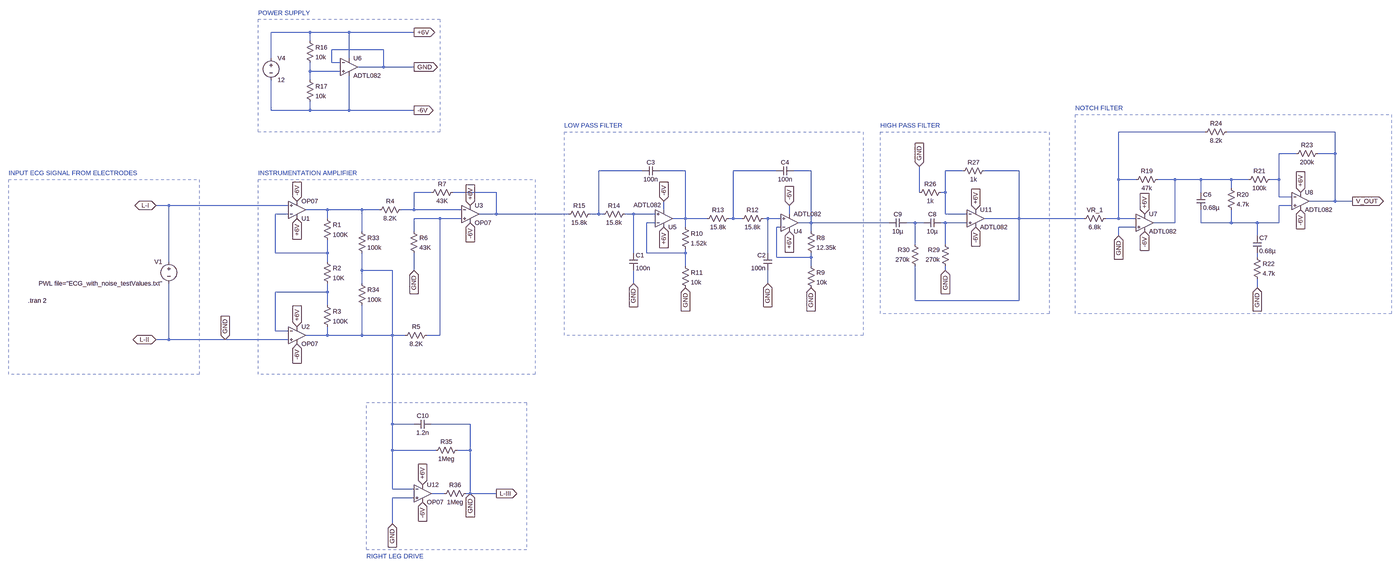
[diagram p0: schematic final_setup_with_opamp_power_supply.asc, whole sheet]
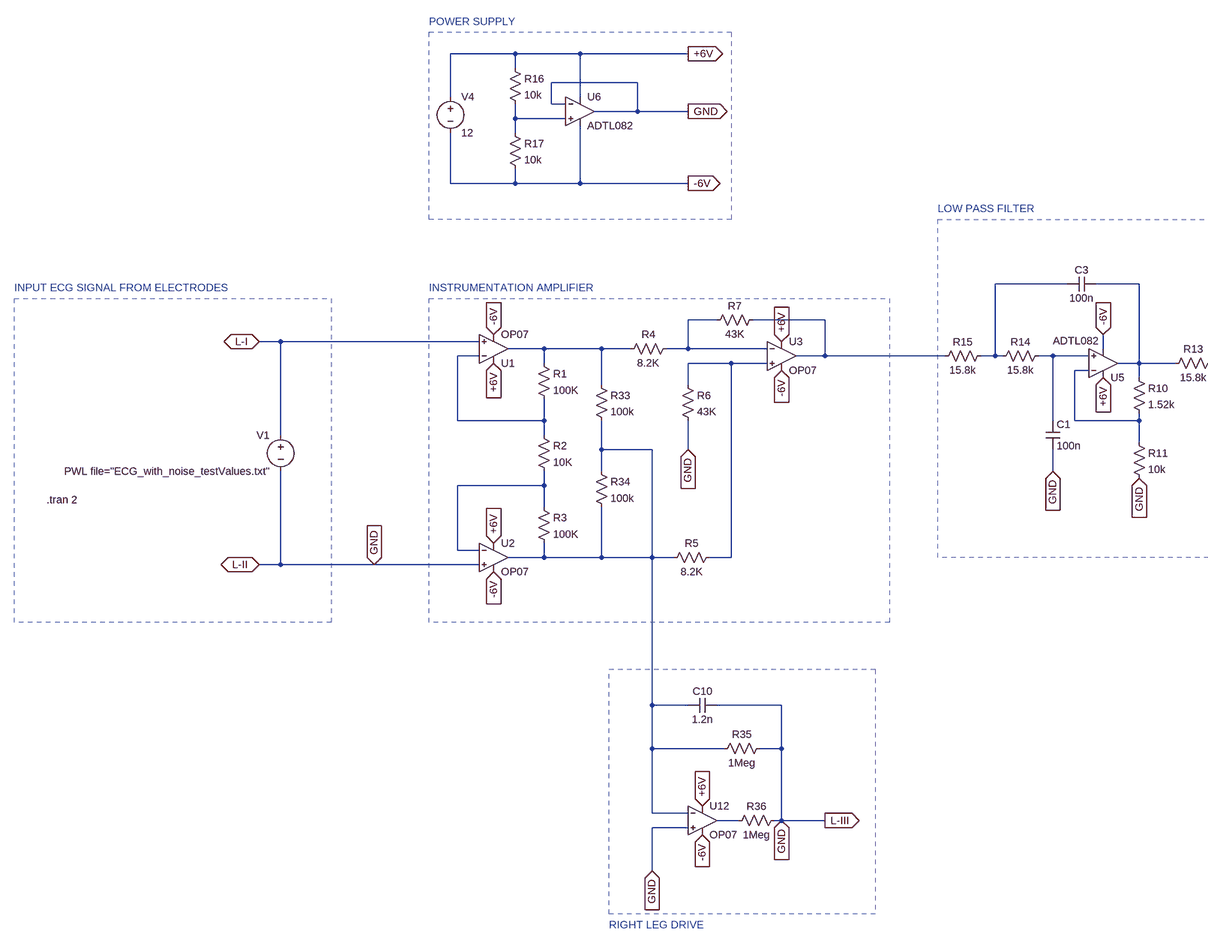
[diagram p1: schematic final_setup_with_opamp_power_supply.asc, part, row 1 of 1, column 1 of 2]
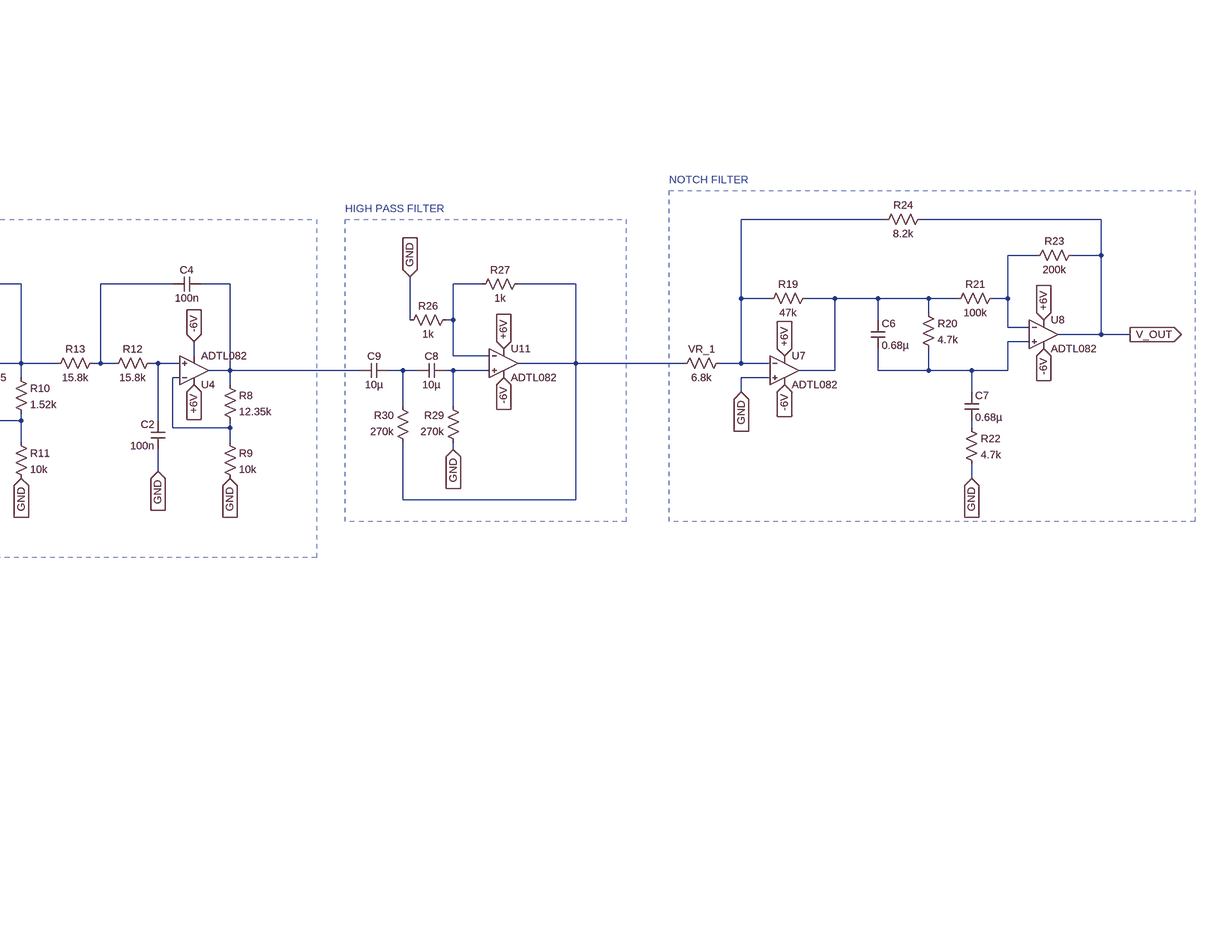
[diagram p2: schematic final_setup_with_opamp_power_supply.asc, part, row 1 of 1, column 2 of 2]
final_setup_with_opamp_power_supply.asc, the LTspice schematic file:
Version 4.1
SHEET 1 4228 1256
WIRE -592 -720 -736 -720
WIRE -448 -720 -592 -720
WIRE -208 -720 -448 -720
WIRE -592 -688 -592 -720
WIRE -320 -656 -512 -656
WIRE -736 -624 -736 -720
WIRE -448 -624 -448 -720
WIRE -512 -608 -512 -656
WIRE -480 -608 -512 -608
WIRE -320 -592 -320 -656
WIRE -320 -592 -416 -592
WIRE -208 -592 -320 -592
WIRE -592 -576 -592 -608
WIRE -480 -576 -592 -576
WIRE -592 -544 -592 -576
WIRE -736 -432 -736 -544
WIRE -592 -432 -592 -464
WIRE -592 -432 -736 -432
WIRE -448 -432 -448 -560
WIRE -448 -432 -592 -432
WIRE -208 -432 -448 -432
WIRE 2720 -352 2400 -352
WIRE 3200 -352 2800 -352
WIRE 3056 -272 2992 -272
WIRE 3200 -272 3200 -352
WIRE 3200 -272 3136 -272
WIRE 640 -208 480 -208
WIRE 800 -208 704 -208
WIRE 1136 -208 976 -208
WIRE 1264 -208 1200 -208
WIRE 1824 -208 1760 -208
WIRE 2032 -208 1904 -208
WIRE 2400 -176 2400 -352
WIRE 2464 -176 2400 -176
WIRE 2608 -176 2544 -176
WIRE 2704 -176 2608 -176
WIRE 2816 -176 2704 -176
WIRE 2880 -176 2816 -176
WIRE 2992 -176 2992 -272
WIRE 2992 -176 2960 -176
WIRE 2816 -144 2816 -176
WIRE -144 -128 -208 -128
WIRE 96 -128 -64 -128
WIRE 1664 -128 1664 -224
WIRE 1760 -128 1760 -208
WIRE 1760 -128 1744 -128
WIRE 2704 -128 2704 -176
WIRE 2992 -112 2992 -176
WIRE 3040 -112 2992 -112
WIRE 3200 -96 3200 -272
WIRE 3200 -96 3104 -96
WIRE 3264 -96 3200 -96
WIRE -1120 -80 -1168 -80
WIRE -672 -80 -1120 -80
WIRE 3040 -80 2992 -80
WIRE -528 -64 -608 -64
WIRE -400 -64 -528 -64
WIRE -336 -64 -400 -64
WIRE -208 -64 -208 -128
WIRE -208 -64 -256 -64
WIRE -32 -64 -208 -64
WIRE 720 -64 720 -96
WIRE -672 -48 -720 -48
WIRE 96 -48 96 -128
WIRE 96 -48 32 -48
WIRE 368 -48 96 -48
WIRE 480 -48 480 -208
WIRE 480 -48 448 -48
WIRE 496 -48 480 -48
WIRE 608 -48 576 -48
WIRE 688 -48 608 -48
WIRE 1184 -48 1184 -80
WIRE 1760 -48 1760 -128
WIRE 1840 -48 1760 -48
WIRE -528 -32 -528 -64
WIRE -112 -32 -208 -32
WIRE -32 -32 -112 -32
WIRE 800 -32 800 -208
WIRE 800 -32 752 -32
WIRE 880 -32 800 -32
WIRE 976 -32 976 -208
WIRE 976 -32 960 -32
WIRE 1008 -32 976 -32
WIRE 1104 -32 1088 -32
WIRE 1152 -32 1104 -32
WIRE 2032 -32 2032 -208
WIRE 2032 -32 1904 -32
WIRE 2272 -32 2032 -32
WIRE 2400 -32 2400 -176
WIRE 2400 -32 2352 -32
WIRE 2464 -32 2400 -32
WIRE 688 -16 656 -16
WIRE 1264 -16 1264 -208
WIRE 1264 -16 1216 -16
WIRE 1552 -16 1264 -16
WIRE 1648 -16 1616 -16
WIRE 1680 -16 1648 -16
WIRE 1760 -16 1744 -16
WIRE 1840 -16 1760 -16
WIRE 2608 -16 2608 -176
WIRE 2608 -16 2528 -16
WIRE 2704 -16 2704 -64
WIRE 2816 -16 2816 -64
WIRE 2816 -16 2704 -16
WIRE 2912 -16 2816 -16
WIRE 2992 -16 2992 -80
WIRE 2992 -16 2912 -16
WIRE 800 0 800 -32
WIRE 1152 0 1136 0
WIRE 2464 0 2400 0
WIRE -400 16 -400 -64
WIRE -208 16 -208 -32
WIRE 1264 16 1264 -16
WIRE 2400 32 2400 0
WIRE 2912 32 2912 -16
WIRE 1648 64 1648 -16
WIRE 1760 64 1760 -16
WIRE -720 96 -720 -48
WIRE -528 96 -528 48
WIRE -528 96 -720 96
WIRE 608 96 608 -48
WIRE 656 96 656 -16
WIRE 800 96 800 80
WIRE 800 96 656 96
WIRE 1104 96 1104 -32
WIRE 1136 112 1136 0
WIRE 1264 112 1264 96
WIRE 1264 112 1136 112
WIRE 2912 112 2912 96
WIRE -1120 128 -1120 -80
WIRE -528 128 -528 96
WIRE 800 144 800 96
WIRE 1264 144 1264 112
WIRE -400 160 -400 96
WIRE -288 160 -400 160
WIRE -208 160 -208 96
WIRE 1760 160 1760 144
WIRE -400 208 -400 160
WIRE 608 208 608 160
WIRE 1104 208 1104 160
WIRE 2912 224 2912 192
WIRE -528 240 -528 208
WIRE -528 240 -720 240
WIRE 1648 272 1648 144
WIRE 2032 272 2032 -32
WIRE 2032 272 1648 272
WIRE -528 288 -528 240
WIRE -720 384 -720 240
WIRE -672 384 -720 384
WIRE -528 400 -528 368
WIRE -528 400 -608 400
WIRE -400 400 -400 288
WIRE -400 400 -528 400
WIRE -288 400 -288 160
WIRE -288 400 -400 400
WIRE -240 400 -288 400
WIRE -112 400 -112 -32
WIRE -112 400 -160 400
WIRE -1120 416 -1120 208
WIRE -1120 416 -1168 416
WIRE -912 416 -1120 416
WIRE -672 416 -912 416
WIRE -288 752 -288 400
WIRE -208 752 -288 752
WIRE 0 752 -144 752
WIRE -288 848 -288 752
WIRE -128 848 -288 848
WIRE 0 848 0 752
WIRE 0 848 -48 848
WIRE -288 992 -288 848
WIRE -208 992 -288 992
WIRE -96 1008 -144 1008
WIRE 0 1008 0 848
WIRE 0 1008 -16 1008
WIRE 96 1008 0 1008
WIRE -208 1024 -288 1024
WIRE -288 1120 -288 1024
FLAG -640 -32 +6V
IOPIN -640 -32 In
FLAG -640 368 +6V
IOPIN -640 368 In
FLAG -640 -96 -6V
IOPIN -640 -96 In
FLAG -640 432 -6V
IOPIN -640 432 In
FLAG 0 -16 -6V
IOPIN 0 -16 In
FLAG 0 -80 +6V
IOPIN 0 -80 In
FLAG -1168 -80 L-I
IOPIN -1168 -80 BiDir
FLAG -1168 416 L-II
IOPIN -1168 416 BiDir
FLAG 720 0 +6V
IOPIN 720 0 In
FLAG 1184 16 +6V
IOPIN 1184 16 In
FLAG 720 -96 -6V
IOPIN 720 -96 In
FLAG 1184 -80 -6V
IOPIN 1184 -80 In
FLAG 2496 -48 +6V
IOPIN 2496 -48 In
FLAG 3072 -128 +6V
IOPIN 3072 -128 In
FLAG 2496 16 -6V
IOPIN 2496 16 In
FLAG 3072 -64 -6V
IOPIN 3072 -64 In
FLAG 1872 -64 +6V
IOPIN 1872 -64 In
FLAG 1872 0 -6V
IOPIN 1872 0 In
FLAG -912 416 GND
IOPIN -912 416 In
FLAG -208 160 GND
IOPIN -208 160 In
FLAG 608 208 GND
IOPIN 608 208 In
FLAG 800 224 GND
IOPIN 800 224 In
FLAG 1104 208 GND
IOPIN 1104 208 In
FLAG 1264 224 GND
IOPIN 1264 224 In
FLAG 1664 -224 GND
IOPIN 1664 -224 In
FLAG 1760 160 GND
IOPIN 1760 160 In
FLAG 2400 32 GND
IOPIN 2400 32 In
FLAG 2912 224 GND
IOPIN 2912 224 In
FLAG -176 976 +6V
IOPIN -176 976 In
FLAG -176 1040 -6V
IOPIN -176 1040 In
FLAG -288 1120 GND
IOPIN -288 1120 In
FLAG 96 1008 L-III
IOPIN 96 1008 Out
FLAG 0 1008 GND
IOPIN 0 1008 In
FLAG 3264 -96 V_OUT
IOPIN 3264 -96 Out
FLAG -208 -720 +6V
IOPIN -208 -720 Out
FLAG -208 -432 -6V
IOPIN -208 -432 Out
FLAG -208 -592 GND
IOPIN -208 -592 Out
SYMBOL OpAmps/OP07 -640 0 M180
SYMATTR InstName U1
SYMBOL Res -544 -48 R0
SYMATTR InstName R1
SYMATTR Value 100K
SYMBOL Res -544 112 R0
SYMATTR InstName R2
SYMATTR Value 10K
SYMBOL Res -544 272 R0
SYMATTR InstName R3
SYMATTR Value 100K
SYMBOL OpAmps/OP07 -640 336 R0
SYMATTR InstName U2
SYMBOL Voltage -1120 112 M0
WINDOW 123 0 0 Left 0
WINDOW 39 0 0 Left 0
SYMATTR InstName V1
SYMATTR Value PWL file="ECG_with_noise_testValues.txt"
SYMBOL Res -240 -80 R90
WINDOW 0 0 56 VBottom 2
WINDOW 3 32 56 VTop 2
SYMATTR InstName R4
SYMATTR Value 8.2K
SYMBOL Res -144 384 R90
WINDOW 0 0 56 VBottom 2
WINDOW 3 32 56 VTop 2
SYMATTR InstName R5
SYMATTR Value 8.2K
SYMBOL Res -224 0 R0
SYMATTR InstName R6
SYMATTR Value 43K
SYMBOL ADTL082 1184 48 M180
SYMATTR InstName U4
SYMBOL ADTL082 720 32 M180
WINDOW 3 -112 114 Left 2
SYMATTR InstName U5
SYMBOL res 1248 0 R0
SYMATTR InstName R8
SYMATTR Value 12.35k
SYMBOL res 1248 128 R0
SYMATTR InstName R9
SYMATTR Value 10k
SYMBOL res 784 -16 R0
SYMATTR InstName R10
SYMATTR Value 1.52k
SYMBOL res 784 128 R0
SYMATTR InstName R11
SYMATTR Value 10k
SYMBOL cap 592 96 R0
SYMATTR InstName C1
SYMATTR Value 100n
SYMBOL cap 1120 96 M0
SYMATTR InstName C2
SYMATTR Value 100n
SYMBOL res 1104 -48 R90
WINDOW 0 0 56 VBottom 2
WINDOW 3 32 56 VTop 2
SYMATTR InstName R12
SYMATTR Value 15.8k
SYMBOL res 976 -48 R90
WINDOW 0 0 56 VBottom 2
WINDOW 3 32 56 VTop 2
SYMATTR InstName R13
SYMATTR Value 15.8k
SYMBOL res 592 -64 R90
WINDOW 0 0 56 VBottom 2
WINDOW 3 32 56 VTop 2
SYMATTR InstName R14
SYMATTR Value 15.8k
SYMBOL res 464 -64 R90
WINDOW 0 0 56 VBottom 2
WINDOW 3 32 56 VTop 2
SYMATTR InstName R15
SYMATTR Value 15.8k
SYMBOL cap 704 -224 R90
WINDOW 0 0 32 VBottom 2
WINDOW 3 32 32 VTop 2
SYMATTR InstName C3
SYMATTR Value 100n
SYMBOL cap 1200 -224 R90
WINDOW 0 0 32 VBottom 2
WINDOW 3 32 32 VTop 2
SYMATTR InstName C4
SYMATTR Value 100n
SYMBOL ADTL082 2496 -80 R0
SYMATTR InstName U7
SYMBOL ADTL082 3072 -160 R0
SYMATTR InstName U8
SYMBOL res 2368 -48 R90
WINDOW 0 0 56 VBottom 2
WINDOW 3 32 56 VTop 2
SYMATTR InstName VR_1
SYMATTR Value 6.8k
SYMATTR SpiceLine tol=5 pwr=0.25
SYMBOL res 2560 -192 R90
WINDOW 0 0 56 VBottom 2
WINDOW 3 32 56 VTop 2
SYMATTR InstName R19
SYMATTR Value 47k
SYMATTR SpiceLine tol=5 pwr=0.25
SYMBOL cap 2688 -128 R0
SYMATTR InstName C6
SYMATTR Value 0.68µ
SYMATTR SpiceLine V=50
SYMBOL res 2800 -160 R0
SYMATTR InstName R20
SYMATTR Value 4.7k
SYMATTR SpiceLine tol=5 pwr=0.25
SYMBOL res 2976 -192 R90
WINDOW 0 0 56 VBottom 2
WINDOW 3 32 56 VTop 2
SYMATTR InstName R21
SYMATTR Value 100k
SYMATTR SpiceLine tol=5 pwr=0.25
SYMBOL cap 2896 32 R0
SYMATTR InstName C7
SYMATTR Value 0.68µ
SYMATTR SpiceLine V=50
SYMBOL res 2896 96 R0
SYMATTR InstName R22
SYMATTR Value 4.7k
SYMATTR SpiceLine tol=5 pwr=0.25
SYMBOL res 3152 -288 R90
WINDOW 0 0 56 VBottom 2
WINDOW 3 32 56 VTop 2
SYMATTR InstName R23
SYMATTR Value 200k
SYMATTR SpiceLine tol=5 pwr=0.25
SYMBOL res 2816 -368 R90
WINDOW 0 0 56 VBottom 2
WINDOW 3 32 56 VTop 2
SYMATTR InstName R24
SYMATTR Value 8.2k
SYMATTR SpiceLine tol=5 pwr=0.25
SYMBOL cap 1744 -32 R90
WINDOW 0 0 32 VBottom 2
WINDOW 3 32 32 VTop 2
SYMATTR InstName C8
SYMATTR Value 10µ
SYMBOL cap 1616 -32 R90
WINDOW 0 0 32 VBottom 2
WINDOW 3 32 32 VTop 2
SYMATTR InstName C9
SYMATTR Value 10µ
SYMBOL res 1760 -144 R90
WINDOW 0 0 56 VBottom 2
WINDOW 3 32 56 VTop 2
SYMATTR InstName R26
SYMATTR Value 1k
SYMBOL res 1920 -224 R90
WINDOW 0 0 56 VBottom 2
WINDOW 3 32 56 VTop 2
SYMATTR InstName R27
SYMATTR Value 1k
SYMBOL res 1776 160 R180
WINDOW 0 36 76 Left 2
WINDOW 3 36 40 Left 2
SYMATTR InstName R29
SYMATTR Value 270k
SYMBOL res 1664 160 R180
WINDOW 0 36 76 Left 2
WINDOW 3 36 40 Left 2
SYMATTR InstName R30
SYMATTR Value 270k
SYMBOL ADTL082 1872 -96 R0
SYMATTR InstName U11
SYMBOL res -416 0 R0
SYMATTR InstName R33
SYMATTR Value 100k
SYMBOL res -416 192 R0
SYMATTR InstName R34
SYMATTR Value 100k
SYMBOL OpAmps/OP07 -176 944 R0
SYMATTR InstName U12
SYMBOL res -32 832 R90
WINDOW 0 0 56 VBottom 2
WINDOW 3 32 56 VTop 2
SYMATTR InstName R35
SYMATTR Value 1Meg
SYMBOL res 0 992 R90
WINDOW 0 0 56 VBottom 2
WINDOW 3 32 56 VTop 2
SYMATTR InstName R36
SYMATTR Value 1Meg
SYMBOL cap -144 736 R90
WINDOW 0 0 32 VBottom 2
WINDOW 3 32 32 VTop 2
SYMATTR InstName C10
SYMATTR Value 1.2n
SYMBOL OpAmps/OP07 0 -112 R0
SYMATTR InstName U3
SYMBOL Res -48 -144 R90
WINDOW 0 0 56 VBottom 2
WINDOW 3 32 56 VTop 2
SYMATTR InstName R7
SYMATTR Value 43K
SYMBOL voltage -736 -640 R0
WINDOW 123 0 0 Left 0
WINDOW 39 0 0 Left 0
SYMATTR InstName V4
SYMATTR Value 12
SYMBOL res -608 -704 R0
SYMATTR InstName R16
SYMATTR Value 10k
SYMBOL res -608 -560 R0
SYMATTR InstName R17
SYMATTR Value 10k
SYMBOL OpAmps\\ADTL082 -448 -656 R0
SYMATTR InstName U6
TEXT -1640 272 Left 2 !.tran 2
TEXT -1712 -200 Left 2 ;INPUT ECG SIGNAL FROM ELECTRODES
TEXT -784 -200 Left 2 ;INSTRUMENTATION AMPLIFIER
TEXT -384 1240 Left 2 ;RIGHT LEG DRIVE
TEXT 352 -376 Left 2 ;LOW PASS FILTER
TEXT 1520 -376 Left 2 ;HIGH PASS FILTER
TEXT 2240 -440 Left 2 ;NOTCH FILTER
TEXT -784 -792 Left 2 ;POWER SUPPLY
RECTANGLE Normal -1008 544 -1712 -176 1
RECTANGLE Normal 240 544 -784 -176 1
RECTANGLE Normal 208 1216 -384 672 1
RECTANGLE Normal 1456 400 352 -352 1
RECTANGLE Normal 2144 320 1520 -352 1
RECTANGLE Normal 2240 -432 2240 -432 1
RECTANGLE Normal 3408 320 2240 -416 1
RECTANGLE Normal -112 -352 -784 -768 1

The netlist it stands for:
* final_setup_with_opamp_power_supply.asc
X§U1 L-I N015 +6V -6V N014 LT1001  ; OP07, pins In+ In- V+ V- OUT
R1 N014 N015 100K
R2 N015 N025 10K
R3 N025 N024 100K
X§U2 L-III N025 +6V -6V N024 LT1001  ; OP07, pins In+ In- V+ V- OUT
V1 L-I L-III PWL file="ECG_with_noise_testValues.txt"
R4 N011 N014 8.2K
R5 N017 N024 8.2K
R6 N017 L-III 43K
X§U4 N018 N022 +6V -6V N007 ADTL082  ; pins In+ In- V+ V- OUT
X§U5 N016 N019 +6V -6V N005 ADTL082  ; pins In+ In- V+ V- OUT
R8 N007 N022 12.35k
R9 N022 L-III 10k
R10 N005 N019 1.52k
R11 N019 L-III 10k
C1 N016 L-III 100n
C2 N018 L-III 100n
R12 N018 N006 15.8k
R13 N006 N005 15.8k
R14 N016 N004 15.8k
R15 N004 N012 15.8k
C3 N005 N004 100n
C4 N007 N006 100n
X§U7 L-III N002 +6V -6V N010 ADTL082  ; pins In+ In- V+ V- OUT
X§U8 N013 N003 +6V -6V V_OUT ADTL082  ; pins In+ In- V+ V- OUT
R§VR_1 N002 N009 6.8k tol=5 pwr=0.25
R19 N010 N002 47k tol=5 pwr=0.25
C6 N010 N013 0.68µ V=50
R20 N010 N013 4.7k tol=5 pwr=0.25
R21 N003 N010 100k tol=5 pwr=0.25
C7 N013 N023 0.68µ V=50
R22 N023 L-III 4.7k tol=5 pwr=0.25
R23 V_OUT N003 200k tol=5 pwr=0.25
R24 V_OUT N002 8.2k tol=5 pwr=0.25
C8 N021 N020 10µ
C9 N020 N007 10µ
R26 N008 L-III 1k
R27 N009 N008 1k
R29 L-III N021 270k
R30 N009 N020 270k
X§U11 N021 N008 +6V -6V N009 ADTL082  ; pins In+ In- V+ V- OUT
R33 N014 N024 100k
R34 N024 N024 100k
X§U12 L-III N024 +6V -6V N026 LT1001  ; OP07, pins In+ In- V+ V- OUT
R35 L-III N024 1Meg
R36 L-III N026 1Meg
C10 L-III N024 1.2n
X§U3 N017 N011 +6V -6V N012 LT1001  ; OP07, pins In+ In- V+ V- OUT
R7 N012 N011 43K
V4 +6V -6V 12
R16 +6V N001 10k
R17 N001 -6V 10k
X§U6 N001 L-III +6V -6V L-III ADTL082  ; pins In+ In- V+ V- OUT
.tran 2
* INPUT ECG SIGNAL FROM ELECTRODES
* INSTRUMENTATION AMPLIFIER
* RIGHT LEG DRIVE
* LOW PASS FILTER
* HIGH PASS FILTER
* NOTCH FILTER
* POWER SUPPLY
.lib LTC.lib
.lib ADI.lib
.backanno
.end